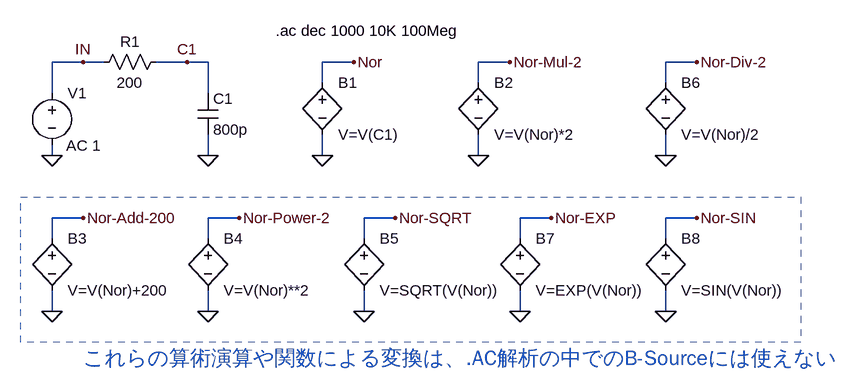
[diagram p0: schematic Fig_2-68_AC_B-Source.asc]
Fig_2-68_AC_B-Source.asc, the LTspice schematic file:
Version 4
SHEET 1 1612 884
WIRE 304 256 256 256
WIRE 336 256 304 256
WIRE 464 256 416 256
WIRE 496 256 464 256
WIRE 720 256 672 256
WIRE 960 256 912 256
WIRE 1248 256 1200 256
WIRE 672 288 672 256
WIRE 912 288 912 256
WIRE 1200 288 1200 256
WIRE 256 304 256 256
WIRE 496 304 496 256
WIRE 256 400 256 384
WIRE 496 400 496 368
WIRE 672 400 672 368
WIRE 912 400 912 368
WIRE 1200 400 1200 368
WIRE 304 496 256 496
WIRE 544 496 496 496
WIRE 784 496 736 496
WIRE 1024 496 976 496
WIRE 1248 496 1200 496
WIRE 256 528 256 496
WIRE 496 528 496 496
WIRE 736 528 736 496
WIRE 976 528 976 496
WIRE 1200 528 1200 496
WIRE 256 640 256 608
WIRE 496 640 496 608
WIRE 736 640 736 608
WIRE 976 640 976 608
WIRE 1200 640 1200 608
FLAG 496 400 0
FLAG 256 400 0
FLAG 304 256 IN
FLAG 464 256 C1
FLAG 672 400 0
FLAG 720 256 Nor
FLAG 912 400 0
FLAG 960 256 Nor-Mul-2
FLAG 256 640 0
FLAG 304 496 Nor-Add-200
FLAG 496 640 0
FLAG 544 496 Nor-Power-2
FLAG 736 640 0
FLAG 784 496 Nor-SQRT
FLAG 1200 400 0
FLAG 1248 256 Nor-Div-2
FLAG 976 640 0
FLAG 1024 496 Nor-EXP
FLAG 1200 640 0
FLAG 1248 496 Nor-SIN
SYMBOL voltage 256 288 R0
WINDOW 123 22 97 Left 2
WINDOW 39 0 0 Left 0
WINDOW 3 24 44 Left 2
SYMATTR Value2 AC 1
SYMATTR Value ""
SYMATTR InstName V1
SYMBOL cap 480 304 R0
SYMATTR InstName C1
SYMATTR Value 800p
SYMBOL res 320 272 R270
WINDOW 0 32 56 VTop 2
WINDOW 3 0 56 VBottom 2
SYMATTR InstName R1
SYMATTR Value 200
SYMBOL bv 672 272 R0
SYMATTR InstName B1
SYMATTR Value V=V(C1)
SYMBOL bv 912 272 R0
SYMATTR InstName B2
SYMATTR Value V=V(Nor)*2
SYMBOL bv 256 512 R0
SYMATTR InstName B3
SYMATTR Value V=V(Nor)+200
SYMBOL bv 496 512 R0
SYMATTR InstName B4
SYMATTR Value V=V(Nor)**2
SYMBOL bv 736 512 R0
SYMATTR InstName B5
SYMATTR Value V=SQRT(V(Nor))
SYMBOL bv 1200 272 R0
SYMATTR InstName B6
SYMATTR Value V=V(Nor)/2
SYMBOL bv 976 512 R0
SYMATTR InstName B7
SYMATTR Value V=EXP(V(Nor))
SYMBOL bv 1200 512 R0
SYMATTR InstName B8
SYMATTR Value V=SIN(V(Nor))
TEXT 600 208 Left 2 !.ac dec 1000 10K 100Meg
TEXT 304 712 Left 3 ;これらの算術演算や関数による変換は、.AC解析の中でのB-Sourceには使えない
RECTANGLE Normal 1408 688 208 464 2

The netlist it stands for:
* Fig_2-68_AC_B-Source.asc
V1 IN 0 AC 1
C1 C1 0 800p
R1 IN C1 200
B1 Nor 0 V=V(C1)
B2 Nor-Mul-2 0 V=V(Nor)*2
B3 Nor-Add-200 0 V=V(Nor)+200
B4 Nor-Power-2 0 V=V(Nor)**2
B5 Nor-SQRT 0 V=SQRT(V(Nor))
B6 Nor-Div-2 0 V=V(Nor)/2
B7 Nor-EXP 0 V=EXP(V(Nor))
B8 Nor-SIN 0 V=SIN(V(Nor))
.ac dec 1000 10K 100Meg
* これらの算術演算や関数による変換は、.AC解析の中でのB-Sourceには使えない
.backanno
.end